# Altium schematic sheet ctrl.SchDoc: Project SHED
size A4; DrawnBy: ultralyj; DocumentNumber: 2; Revision: 0.1; SheetNumber: 2; SheetTotal: 2
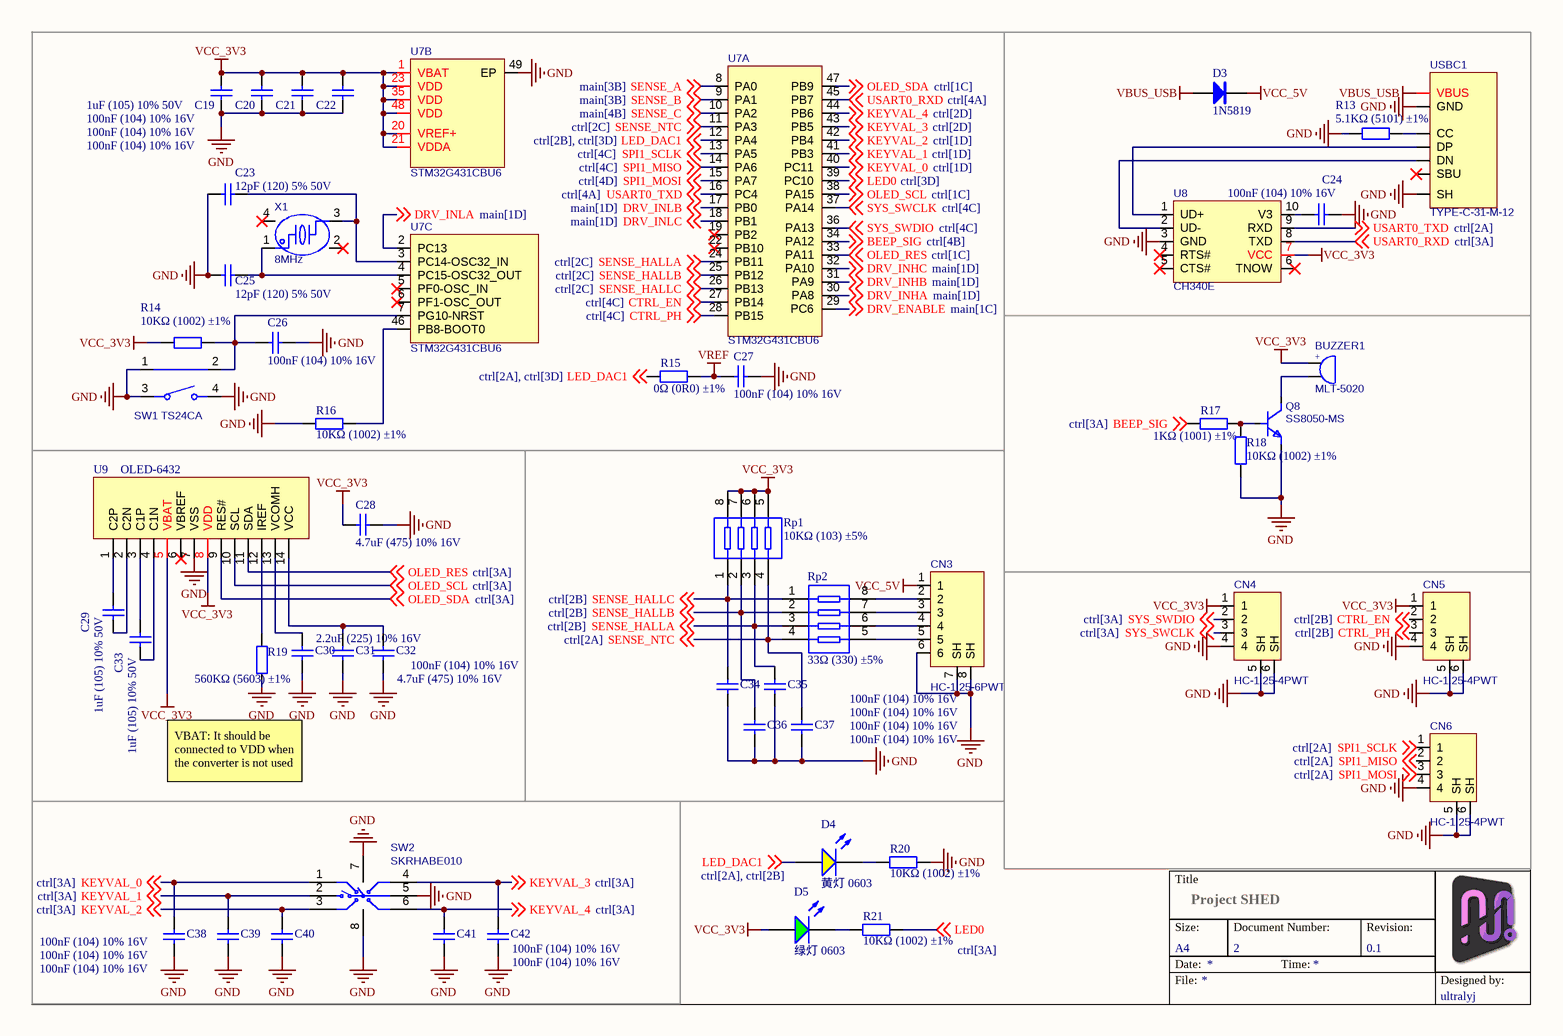
[diagram p0: ctrl.SchDoc]

## Parts
BUZZER1  MLT-5020  [BUZ-SMD_L5.0-W5.5-P4.60]
C19  1uF (105) 10% 50V  [LC-0603_C_NOSILK]
C20  100nF (104) 10% 16V  [LC-0402_C_NOSILK]
C21  100nF (104) 10% 16V  [LC-0402_C_NOSILK]
C22  100nF (104) 10% 16V  [LC-0402_C_NOSILK]
C23  12pF (120) 5% 50V  [LC-0402_C_NOSILK]
C24  100nF (104) 10% 16V  [LC-0402_C_NOSILK]
C25  12pF (120) 5% 50V  [LC-0402_C_NOSILK]
C26  100nF (104) 10% 16V  [LC-0402_C_NOSILK]
C27  100nF (104) 10% 16V  [LC-0402_C_NOSILK]
C28  4.7uF (475) 10% 16V  [LC-0603_C_NOSILK]
C29  1uF (105) 10% 50V  [LC-0603_C_NOSILK]
C30  2.2uF (225) 10% 16V  [LC-0603_C_NOSILK]
C31  4.7uF (475) 10% 16V  [LC-0603_C_NOSILK]
C32  100nF (104) 10% 16V  [LC-0402_C_NOSILK]
C33  1uF (105) 10% 50V  [LC-0603_C_NOSILK]
C34  100nF (104) 10% 16V  [LC-0402_C_NOSILK]
C35  100nF (104) 10% 16V  [LC-0402_C_NOSILK]
C36  100nF (104) 10% 16V  [LC-0402_C_NOSILK]
C37  100nF (104) 10% 16V  [LC-0402_C_NOSILK]
C38  100nF (104) 10% 16V  [LC-0402_C_NOSILK]
C39  100nF (104) 10% 16V  [LC-0402_C_NOSILK]
C40  100nF (104) 10% 16V  [LC-0402_C_NOSILK]
C41  100nF (104) 10% 16V  [LC-0402_C_NOSILK]
C42  100nF (104) 10% 16V  [LC-0402_C_NOSILK]
CN3  HC-1.25-6PWT  [CONN-SMD_6P-P1.25_HC-1.25-6PWT]
CN4  HC-1.25-4PWT  [CONN-SMD_4P-P1.25-HC-1.25-4PWT]
CN5  HC-1.25-4PWT  [CONN-SMD_4P-P1.25-HC-1.25-4PWT]
CN6  HC-1.25-4PWT  [CONN-SMD_4P-P1.25-HC-1.25-4PWT]
D3  1N5819  [SOD-323]
D4  黄灯 0603  [0603_LED_S1]
D5  绿灯 0603  [0603_LED_S1]
Q8  SS8050-MS  [SOT-23-3_L2.9-W1.3-P0.95-LS2.4-BR]
R13  5.1KΩ (5101) ±1%  [LC-0402_R_NOSILK]
R14  10KΩ (1002) ±1%  [LC-0402_R_NOSILK]
R15  0Ω (0R0) ±1%  [LC-0402_R_NOSILK]
R16  10KΩ (1002) ±1%  [LC-0402_R_NOSILK]
R17  1KΩ (1001) ±1%  [0402_R]
R18  10KΩ (1002) ±1%  [0402_R]
R19  560KΩ (5603) ±1%  [LC-0603_R_NOSILK]
R20  10KΩ (1002) ±1%  [LC-0402_R_NOSILK]
R21  10KΩ (1002) ±1%  [0402_R]
Rp1  10KΩ (103) ±5%  [0402_Rx4]
Rp2  33Ω (330) ±5%  [0402_Rx4]
SW1  TS24CA  [SW-SMD_TS24CA]
SW2  SKRHABE010  [SW-SMD_SKRHABE010]
U7  STM32G431CBU6  [UFQFPN-48_L7.0-W7.0-P0.50-BL-EP]  (parts A,B,C of 3)
U8  CH340E  [MSOP-10_L3.0-W3.0-P0.50-LS5.0-BL]
U9  OLED-6432  [OLED-6432-TOP]
USBC1  TYPE-C-31-M-12  [USB-C_SMD-TYPE-C-31-M-12]
X1  8MHz  [CRYSTAL-SMD_4P-L3.2-W2.5-BL]

## Nets
GND: C19.1 C20.1 C21.1 C22.1 C23.1 C24.2 C25.1 C26.2 C27.2 C28.1 C30.1 C31.1 C32.1 C34.1 C35.1 C36.1 C37.1 C38.1 C39.1 C40.1 C41.1 C42.1 CN3.6 CN3.7(SH) CN3.8(SH) CN4.4 CN4.5(SH) CN4.6(SH) CN5.4 CN5.5(SH) CN5.6(SH) CN6.4 CN6.5(SH) CN6.6(SH) Q8.2(E) R13.1 R16.1 R18.1 R19.1 R20.2 SW1.1 SW1.3 SW1.4 SW2.5(COM) SW2.7 SW2.8 U7.49(EP) U8.3(GND) U9.7(VSS) USBC1.0,1,2,3(SH) USBC1.A1,B1,A12,B12(GND)
VBUS_USB: D3.1(A) USBC1.A4,A9,B4,B9(VBUS)
VCC_3V3: BUZZER1.1 C19.2 C20.2 C21.2 C22.2 C28.2 CN4.1 CN5.1 D5.A R14.1 Rp1.5 Rp1.6 Rp1.7 Rp1.8 U7.1(VBAT) U7.20(VREF+) U7.21(VDDA) U7.23(VDD) U7.35(VDD) U7.48(VDD) U8.7(VCC) U9.5(VBAT) U9.8(VDD)
VCC_5V: CN3.1 D3.2(K)
VREF: C27.1 R15.2
BEEP_SIG: R17.1 U7.34(PA12) ; off-sheet BEEP_SIG
CTRL_EN: CN5.2 U7.27(PB14) ; off-sheet CTRL_EN
CTRL_PH: CN5.3 U7.28(PB15) ; off-sheet CTRL_PH
DRV_ENABLE: U7.29(PC6) ; off-sheet DRV_ENABLE
DRV_INHA: U7.30(PA8) ; off-sheet DRV_INHA
DRV_INHB: U7.31(PA9) ; off-sheet DRV_INHB
DRV_INHC: U7.32(PA10) ; off-sheet DRV_INHC
DRV_INLA: U7.2(PC13) ; off-sheet DRV_INLA
DRV_INLB: U7.17(PB0) ; off-sheet DRV_INLB
DRV_INLC: U7.18(PB1) ; off-sheet DRV_INLC
KEYVAL_0: C38.2 SW2.1(A) U7.40(PC11) ; off-sheet KEYVAL_0
KEYVAL_1: C39.2 SW2.2(CEN) U7.41(PB3) ; off-sheet KEYVAL_1
KEYVAL_2: C40.2 SW2.3(C) U7.42(PB4) ; off-sheet KEYVAL_2
KEYVAL_3: C42.2 SW2.4(D) U7.43(PB5) ; off-sheet KEYVAL_3
KEYVAL_4: C41.2 SW2.6(B) U7.44(PB6) ; off-sheet KEYVAL_4
LED0: R21.2 U7.39(PC10) ; off-sheet LED0
LED_DAC1: D4.A R15.1 U7.12(PA4) ; off-sheet LED_DAC1
OLED_RES: U7.33(PA11) U9.11(SDA) ; off-sheet OLED_RES
OLED_SCL: U7.38(PA15) U9.10(SCL) ; off-sheet OLED_SCL
OLED_SDA: U7.47(PB9) U9.9(RES#) ; off-sheet OLED_SDA
SENSE_A: U7.8(PA0) ; off-sheet SENSE_A
SENSE_B: U7.9(PA1) ; off-sheet SENSE_B
SENSE_C: U7.10(PA2) ; off-sheet SENSE_C
SENSE_HALLA: C35.2 Rp1.3 Rp2.3 U7.24(PB11) ; off-sheet SENSE_HALLA
SENSE_HALLB: C36.2 Rp1.2 Rp2.2 U7.25(PB12) ; off-sheet SENSE_HALLB
SENSE_HALLC: C34.2 Rp1.1 Rp2.1 U7.26(PB13) ; off-sheet SENSE_HALLC
SENSE_NTC: C37.2 Rp1.4 Rp2.4 U7.11(PA3) ; off-sheet SENSE_NTC
SPI1_MISO: CN6.2 U7.14(PA6) ; off-sheet SPI1_MISO
SPI1_MOSI: CN6.3 U7.15(PA7) ; off-sheet SPI1_MOSI
SPI1_SCLK: CN6.1 U7.13(PA5) ; off-sheet SPI1_SCLK
SYS_SWCLK: CN4.3 U7.37(PA14) ; off-sheet SYS_SWCLK
SYS_SWDIO: CN4.2 U7.36(PA13) ; off-sheet SYS_SWDIO
USART0_RXD: U7.45(PB7) U8.8(TXD) ; off-sheet USART0_RXD
USART0_TXD: U7.16(PC4) U8.9(RXD) ; off-sheet USART0_TXD
NetBUZZER1_2: BUZZER1.2 Q8.3(C)
NetC23_2: C23.2 U7.3(PC14-OSC32_IN) X1.3
NetC24_1: C24.1 U8.10(V3)
NetC25_2: C25.2 U7.4(PC15-OSC32_OUT) X1.1
NetC26_1: C26.1 R14.2 SW1.2 U7.7(PG10-NRST)
NetC29_1: C29.1 U9.2(C2N)
NetC29_2: C29.2 U9.1(C2P)
NetC30_2: C30.2 U9.13(VCOMH)
NetC31_2: C31.2 C32.2 U9.14(VCC)
NetC33_1: C33.1 U9.4(C1N)
NetC33_2: C33.2 U9.3(C1P)
NetCN3_2: CN3.2 Rp2.8
NetCN3_3: CN3.3 Rp2.7
NetCN3_4: CN3.4 Rp2.6
NetCN3_5: CN3.5 Rp2.5
NetD4_K: D4.K R20.1
NetD5_K: D5.K R21.1
NetQ8_1: Q8.1(B) R17.2 R18.2
NetR13_2: R13.2 USBC1.A5,B5(CC)
NetR16_2: R16.2 U7.46(PB8-BOOT0)
NetR19_2: R19.2 U9.12(IREF)
NetU8_1: U8.1(UD+) USBC1.A6,B6(DP)
NetU8_2: U8.2(UD-) USBC1.A7,B7(DN)

Not connected (* = marked no-connect by the designer): U7 5(PF0-OSC_IN)* 6(PF1-OSC_OUT)* 19(PB2)* 22(PB10)*; U8 4(RTS#)* 5(CTS#)* 6(TNOW)*; U9 6(VBREF)*; USBC1 A8,B8(SBU)*; X1 2(GND)* 4(GND)*

## Notes on the sheet
- VBAT: It should be connected to VDD when the converter is not used
- Title
- Size:
- A4
- Date:
- File:
- Document Number:
- Time:
- Revision:
- Designed by:
- (in symbol MLT-5020) +

## Library data of the parts
BUZZER1 = MLT-5020: 薄款贴片无源蜂鸣器; BOM_Manufacturer: 华能; Frequency: 4000Hz; BOM_Supplier: LCSC; BOM_Manufacturer Part: MLT-5020; BOM_Supplier Part: C94598; BOM_JLCPCB Part Class: Extended Part; spicePre: B; spiceSymbolName: MLT-5020
C19 C29 C33 = 0603 1uF (105) 10% 50V: 贴片电容; ComponentLink1Description: 供应商链接; ComponentLink1URL: http://www.szlcsc.com/product/details_16531.html; Package: 0603; Supplier: LC; SuppliersPartNumber: C15849
C20-C22 C24 C26 C27 C32 C34-C42 = 0402 100nF (104) 10% 16V: 贴片电容; ComponentLink1Description: 供应商链接; ComponentLink1URL: http://www.szlcsc.com/product/details_1877.html; Package: 0402; Supplier: LC; SuppliersPartNumber: C1525
C23 C25 = 0402 12pF (120) 5% 50V: 贴片电容; ComponentLink1Description: 供应商链接; ComponentLink1URL: http://www.szlcsc.com/product/details_1899.html; Package: 0402; Supplier: LC; SuppliersPartNumber: C1547
C28 C31 = 0603 4.7uF (475) 10% 16V: 贴片电容; ComponentLink1Description: 供应商链接; ComponentLink1URL: http://www.szlcsc.com/product/details_20375.html; Package: 0603; Supplier: LC; SuppliersPartNumber: C19666
C30 = 0603 2.2uF (225) 10% 16V: 贴片电容; ComponentLink1Description: 供应商链接; ComponentLink1URL: http://www.szlcsc.com/product/details_24366.html; Package: 0603; Supplier: LC; SuppliersPartNumber: C23630
CN3 = HC-1.25-6PWT: 1.25mm 6P 插座; BOM_Manufacturer: HCTL(华灿天禄); Contributor: LCSC; BOM_Supplier: LCSC; BOM_Supplier Part: C2845383; BOM_Manufacturer Part: HC-1.25-6PWT; BOM_JLCPCB Part Class: Extended Part; spicePre: C; spiceSymbolName: HC-1.25-6PWT
CN4-CN6 = HC-1.25-4PWT: 1.25mm 4P 插座; BOM_Manufacturer: HCTL(华灿天禄); Contributor: LCSC; BOM_Supplier: LCSC; BOM_Supplier Part: C2845381; BOM_Manufacturer Part: HC-1.25-4PWT; BOM_JLCPCB Part Class: Extended Part; spicePre: C; spiceSymbolName: HC-1.25-4PWT
D3 = 1N5819: 肖特基二极管; 版权归属: 源创客; 属性: 40V/2A; BOM名称: 肖特基二极管; 学习资源: www.ooocke.com
D4 = 0603 黄灯: 发光二极管; ComponentLink1Description: 供应商链接; ComponentLink1URL: http://www.szlcsc.com/product/details_73147.html; Package: 0603; Supplier: LC; SuppliersPartNumber: C72038
D5 = 0603 绿灯: 发光二极管; ComponentLink1Description: 供应商链接; ComponentLink1URL: http://www.szlcsc.com/product/details_73152.html; Package: 0603; Supplier: LC; SuppliersPartNumber: C72043
Q8 = SS8050-MS: NPN BJT; BOM_Manufacturer: MSKSEMI(美森科); Contributor: lcsc; BOM_Supplier: LCSC; BOM_Supplier Part: C5120748; BOM_Manufacturer Part: SS8050-MS; link: https://atta.szlcsc.comnull; BOM_JLCPCB Part Class: Extended Part; spicePre: U; spiceSymbolName: SS8050-MS
R13 = 0402 5.1KΩ (5101) 1%: 贴片电阻; ComponentLink1Description: 供应商链接; ComponentLink1URL: http://www.szlcsc.com/product/details_26648.html; Package: 0402; Supplier: LC; SuppliersPartNumber: C25905
R14 R16 R18 R20 R21 = 0402 10KΩ (1002) 1%: 贴片电阻; ComponentLink1Description: 供应商链接; ComponentLink1URL: http://www.szlcsc.com/product/details_26487.html; Package: 0402; Supplier: LC; SuppliersPartNumber: C25744
R15 = 0402 0Ω (0R0) 1%: 贴片电阻; ComponentLink1Description: 供应商链接; ComponentLink1URL: http://www.szlcsc.com/product/details_17853.html; Package: 0402; Supplier: LC; SuppliersPartNumber: C17168
R17 = 0402 1KΩ (1001) 1%: 贴片电阻; ComponentLink1Description: 供应商链接; ComponentLink1URL: http://www.szlcsc.com/product/details_12256.html; Package: 0402; Supplier: LC; SuppliersPartNumber: C11702
R19 = 0603 560KΩ (5603) 1%: 贴片电阻; ComponentLink1Description: 供应商链接; ComponentLink1URL: http://www.szlcsc.com/product/details_23930.html; Package: 0603; Supplier: LC; SuppliersPartNumber: C23203
Rp1 = 0402*4 10KΩ (103) 5%: 贴片排阻; ComponentLink1Description: 供应商链接; ComponentLink1URL: http://www.szlcsc.com/product/details_26468.html; Package: 0402*4; Supplier: LC; SuppliersPartNumber: C25725
Rp2 = 0402*4 33Ω (330) 5%: 贴片排阻; ComponentLink1Description: 供应商链接; ComponentLink1URL: http://www.szlcsc.com/product/details_26244.html; Package: 0402*4; Supplier: LC; SuppliersPartNumber: C25501
SW1 = TS24CA: 按键; BOM_Manufacturer: SHOU HAN(首韩); Contributor: LCSC; BOM_Supplier: LCSC; BOM_Supplier Part: C393942; BOM_Manufacturer Part: TS24CA; BOM_JLCPCB Part Class: Extended Part; spicePre: S; spiceSymbolName: TS24CA
SW2 = SKRHABE010: 五向开关; BOM_Manufacturer: ALPSALPINE(阿尔卑斯阿尔派); Contributor: LCSC; BOM_Supplier: LCSC; BOM_Manufacturer Part: SKRHABE010; BOM_Supplier Part: C139794; BOM_JLCPCB Part Class: Extended Part; spicePre: S; spiceSymbolName: SKRHABE010
U7 = STM32G431CBU6: Cortex-M4 MCU; BOM_Manufacturer: ST(意法半导体); Contributor: LCSC; BOM_Supplier: LCSC; BOM_Supplier Part: C529356; BOM_Manufacturer Part: STM32G431CBU6; BOM_JLCPCB Part Class: Extended Part; spicePre: U; spiceSymbolName: STM32G431CBU6
U8 = CH340E: ttl-usb芯片; BOM_Manufacturer: WCH(南京沁恒); BOM_Supplier: LCSC; BOM_Manufacturer Part: CH340E; BOM_Supplier Part: C99652; BOM_JLCPCB Part Class: Extended Part; spicePre: U; spiceSymbolName: CH340E
U9 = OLED-6432: 0.49inch 64-32显示屏
USBC1 = TYPE-C-31-M-12: 贴片type-c母座; BOM_Manufacturer: 韩国韩荣; Contributor: LCSC; BOM_Supplier: LCSC; BOM_Supplier Part: C165948; BOM_Manufacturer Part: TYPE-C-31-M-12; BOM_JLCPCB Part Class: Extended Part; spicePre: U; spiceSymbolName: TYPE-C-31-M-12
X1 = 8MHz: 8MHz无源晶振（负载电容12pF）; BOM_Manufacturer: JWT(晶威特); BOM_Manufacturer Part: CF4008M00012T8188031; Contributor: LCSC; nameAlias: Frequency; BOM_Supplier: LCSC; BOM_Supplier Part: C2933033; spicePre: X; spiceSymbolName: CF4008M00012T8188031